# EAGLE schematic FotbrettRev1 (EAGLE 6.4)
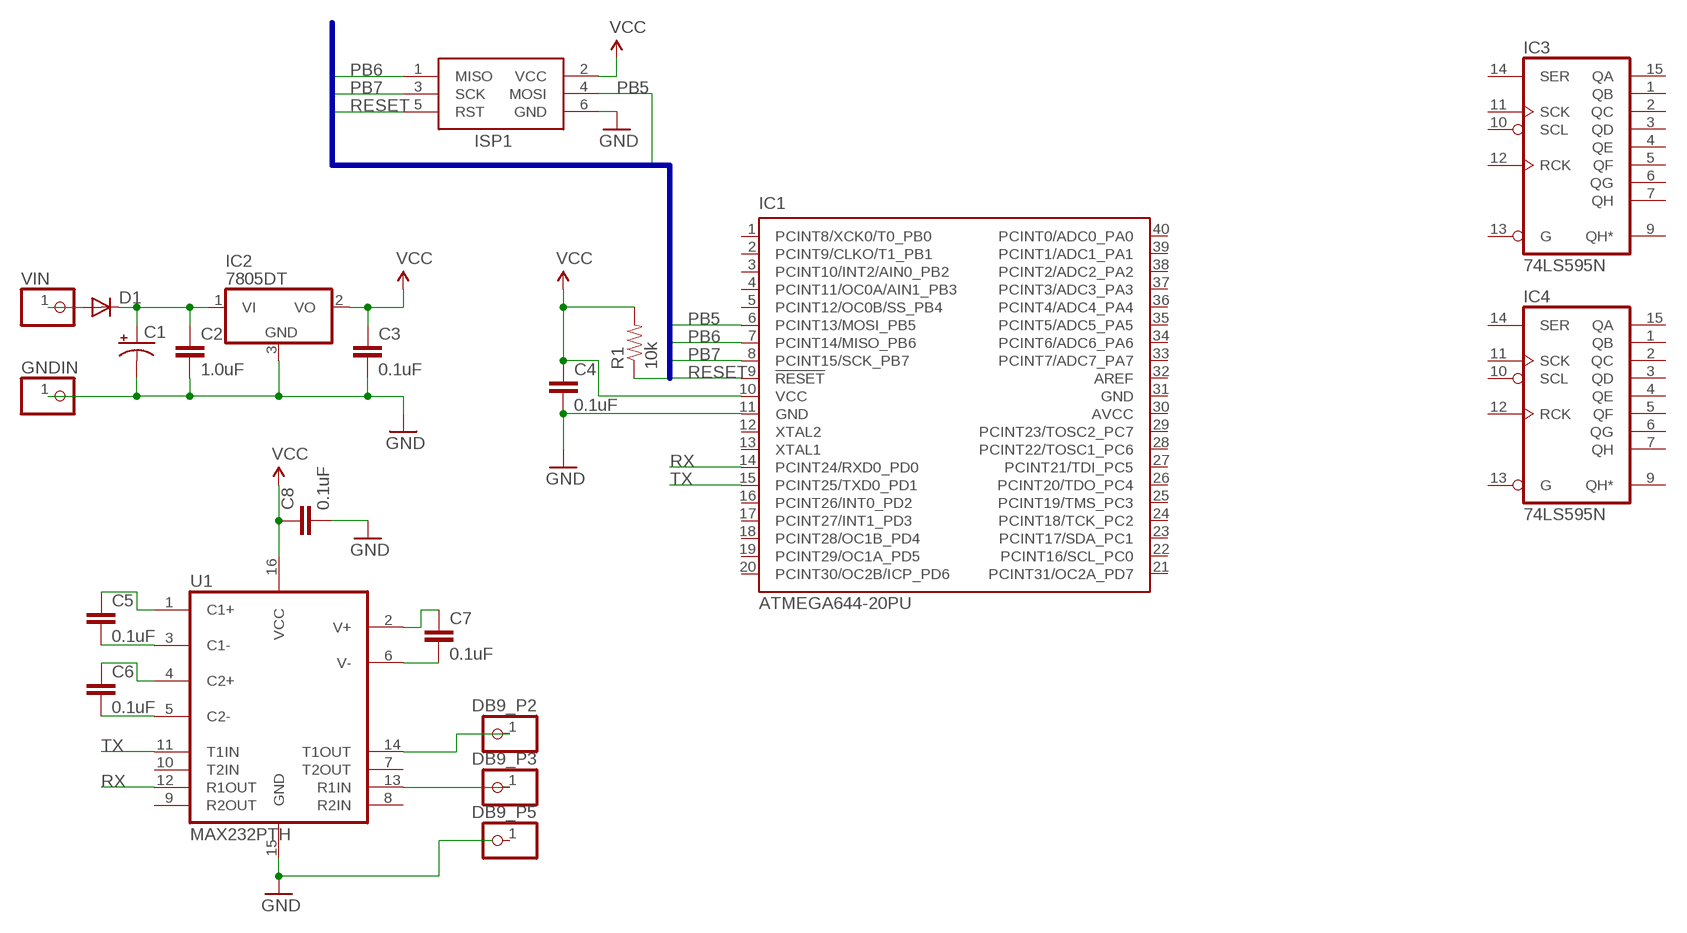
[diagram p0: schematic, sheet 1]

## Parts
C1  CPOL-USE5-10.5  [E5-10,5]
C2  1.0uF  1.0UF-16V-10%(0603)  [0603-CAP]
C3  0.1uF  1.0UF-16V-10%(0603)  [0603-CAP]
C4  0.1uF  1.0UF-16V-10%(0603)  [0603-CAP]
C5  0.1uF  1.0UF-16V-10%(0603)  [0603-CAP]
C6  0.1uF  1.0UF-16V-10%(0603)  [0603-CAP]
C7  0.1uF  1.0UF-16V-10%(0603)  [0603-CAP]
C8  0.1uF  1.0UF-16V-10%(0603)  [0603-CAP]
D1  DIODE1N4148  [DIODE-1N4148]
DB9_P2  PINHD-1X1  [1X01]
DB9_P3  PINHD-1X1  [1X01]
DB9_P5  PINHD-1X1  [1X01]
GNDIN  PINHD-1X1  [1X01]
IC1  ATMEGA644-20PU  [DIL40]
IC2  7805DT  [TO252]
IC3  74LS595N  [DIL16]
IC4  74LS595N  [DIL16]
ISP1  AVRISP-6  [AVRISP]
R1  10k  RESISTOR0603-RES  [0603-RES]
U1  MAX232PTH  [DIL16]
VIN  PINHD-1X1  [1X01]

## Nets
GND: C1.- C2.2 C3.2 C4.2 C8.2 GNDIN.1 IC1.11(GND) IC2.3(GND) ISP1.6(GND) U1.15(GND)
N$1: D1.A VIN.1
N$2: C1.+ C2.1 D1.C IC2.1(VI)
N$3: C5.1 U1.1(C1+)
N$4: C5.2 U1.3(C1-)
N$5: C6.1 U1.4(C2+)
N$6: C6.2 U1.5(C2-)
N$7: C7.2 U1.6(V-)
N$8: C7.1 U1.2(V+)
N$10: DB9_P2.1 U1.14(T1OUT)
N$11: DB9_P3.1 U1.13(R1IN)
PB5: IC1.6(PCINT13/MOSI_PB5) ISP1.4(MOSI)
PB6: IC1.7(PCINT14/MISO_PB6) ISP1.1(MISO)
PB7: IC1.8(PCINT15/SCK_PB7) ISP1.3(SCK)
RESET: IC1.9(!RESET) ISP1.5(RST) R1.1
RX: IC1.14(PCINT24/RXD0_PD0) U1.12(R1OUT)
TX: IC1.15(PCINT25/TXD0_PD1) U1.11(T1IN)
VCC: C3.1 C4.1 C8.1 IC1.10(VCC) IC2.2(VO) ISP1.2(VCC) R1.2 U1.16(VCC)
Unconnected: DB9_P5.1 IC1.1(PCINT8/XCK0/T0_PB0) IC1.2(PCINT9/CLKO/T1_PB1) IC1.3(PCINT10/INT2/AIN0_PB2) IC1.4(PCINT11/OC0A/AIN1_PB3) IC1.5(PCINT12/OC0B/SS_PB4) IC1.12(XTAL2) IC1.13(XTAL1) IC1.16(PCINT26/INT0_PD2) IC1.17(PCINT27/INT1_PD3) IC1.18(PCINT28/OC1B_PD4) IC1.19(PCINT29/OC1A_PD5) IC1.20(PCINT30/OC2B/ICP_PD6) IC1.21(PCINT31/OC2A_PD7) IC1.22(PCINT16/SCL_PC0) IC1.23(PCINT17/SDA_PC1) IC1.24(PCINT18/TCK_PC2) IC1.25(PCINT19/TMS_PC3) IC1.26(PCINT20/TDO_PC4) IC1.27(PCINT21/TDI_PC5) IC1.28(PCINT22/TOSC1_PC6) IC1.29(PCINT23/TOSC2_PC7) IC1.32(AREF) IC1.33(PCINT7/ADC7_PA7) IC1.34(PCINT6/ADC6_PA6) IC1.35(PCINT5/ADC5_PA5) IC1.36(PCINT4/ADC4_PA4) IC1.37(PCINT3/ADC3_PA3) IC1.38(PCINT2/ADC2_PA2) IC1.39(PCINT1/ADC1_PA1) IC1.40(PCINT0/ADC0_PA0) IC3.1(QB) IC3.2(QC) IC3.3(QD) IC3.4(QE) IC3.5(QF) IC3.6(QG) IC3.7(QH) IC3.9(QH*) IC3.10(SCL) IC3.11(SCK) IC3.12(RCK) IC3.13(G) IC3.14(SER) IC3.15(QA) IC4.1(QB) IC4.2(QC) IC4.3(QD) IC4.4(QE) IC4.5(QF) IC4.6(QG) IC4.7(QH) IC4.9(QH*) IC4.10(SCL) IC4.11(SCK) IC4.12(RCK) IC4.13(G) IC4.14(SER) IC4.15(QA) U1.7(T2OUT) U1.8(R2IN) U1.9(R2OUT) U1.10(T2IN)

## Buses
PB[0..7],RESET

## Power pins joined to a net without a drawn wire
AVCC: IC1.30(AVCC)
GND: IC1.31(GND) IC3.8(GND) IC4.8(GND)
VCC: IC3.16(VCC) IC4.16(VCC)

## Library data of the parts
C1 = adafruit:CPOL-US: POLARIZED CAPACITOR, American symbol
C2 = SparkFun-Capacitors:1.0UF-16V-10%(0603): CAP-00868; PROD_ID: CAP-00868
C3-C8 = SparkFun-Capacitors:1.0UF-16V-10%(0603): CAP-00868; PROD_ID: CAP-00868; VALUE: 1.0uF
D1 = SparkFun-DiscreteSemi:DIODE: Diode These are standard reverse protection diodes and small signal diodes. SMA package can handle up to about 1A. SOD-323 can handle about 200mA. What the SOD-323 package when ordering, there are some mfgs out there that are 5-pin packages.
DB9_P2 DB9_P3 DB9_P5 GNDIN VIN = adafruit:PINHD-1X1: Pin header 1x1 for 0.1" spacing With round pins
IC1 = atmel:ATMEGA644-*PU: 8-bit Microcontroller with 64K Bytes In-System Programmable Flash Auto generated by make-symbol-device-package-bsdl.ulp Rev. 34 Source: http://www.atmel.com/dyn/resources/prod_documents/doc2593.pdf; MPN: ATMEGA644-20PU; OC_FARNELL: 1288340; OC_NEWARK: 23M5060
IC2 = adafruit:78*: Positive VOLTAGE REGULATOR Added bigger pads to the TO-92 package
IC3 IC4 = 74xx-eu:74*595: 8-bit SHIFT REGISTER, output latch
ISP1 = adafruit:AVRISP: AVR ISP HEADER Standard 6 pin header for AVR programming
R1 = SparkFun-Resistors:RESISTOR: Resistor Basic schematic elements and footprints for 0603, 1206, and PTH resistors.
U1 = SparkFun-DigitalIC:MAX232: RS232 Transceiver Very common IC. This is generically called 'MAX232', but works with the 3V equivalent MAX3232 generic ICs. Field tested and mother approved. Spark Fun Electronics SKU : COM-00316 (DIP) and COM-00589 (SMD)